# Altium schematic sheet ESC_Header.SchDoc
size A4; SheetNumber: 2; SheetTotal: 2
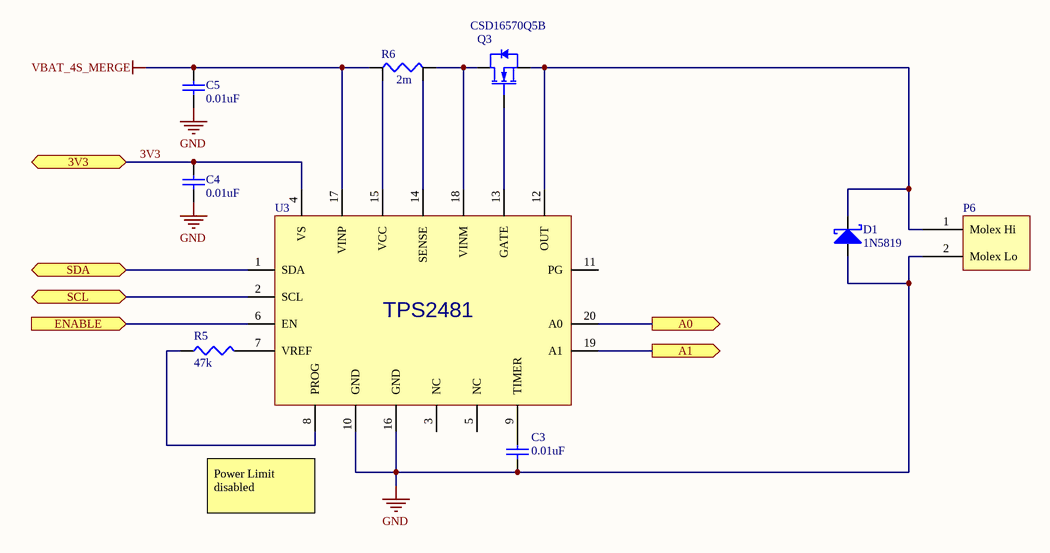
[diagram p0: ESC_Header.SchDoc]

## Parts
C3  value 0.01uF  [C1206]  (hidden comment: Cap Semi)
C4  value 0.01uF  [C1206]  (hidden comment: Cap Semi)
C5  value 0.01uF  [C1206]  (hidden comment: Cap Semi)
D1  1N5819  [1N58xx]
P6  Motor ?  [76829-0102]  (value not drawn)
Q3  CSD16570Q5B  [CSD16570Q5B]
R5  47k  [J1-0603]
R6  2m  [WSL27262L000FEB]
U3  TPS2481  [TPS2481]  (value not drawn)

## Ports
3V3 (bidir), A0 (out), A1 (out), ENABLE (in), SCL (bidir), SDA (bidir)

## Nets
GND: C3.1 C4.1 C5.1 D1.A(Anode) P6.2(Molex_Lo) U3.10(GND) U3.16(GND)
VBAT_4S_MERGE: C5.2 R6.1 U3.17(VINP)
3V3: C4.2 U3.4(VS) ; port 3V3
A0: U3.20(A0) ; port A0
A1: U3.19(A1) ; port A1
ENABLE: U3.6(EN) ; port ENABLE
SCL: U3.2(SCL) ; port SCL
SDA: U3.1(SDA) ; port SDA
NetC3_2: C3.2 U3.9(TIMER)
NetD1_K: D1.K(Cathode) P6.1(Molex_Hi) Q3.S(Source) U3.12(OUT)
NetQ3_D: Q3.D(Drain) R6.2 U3.18(VINM)
NetQ3_G: Q3.G(Gate) U3.13(GATE)
NetR5_1: R5.1 U3.8(PROG)
NetR5_2: R5.2 U3.7(VREF)
NetR6_3: R6.3 U3.15(VCC)
NetR6_4: R6.4 U3.14(SENSE)

Not connected (* = marked no-connect by the designer): U3 3(NC) 5(NC) 11(PG)

## Notes on the sheet
- Power Limit disabled

## Library data of the parts
C3-C5 = Cap Semi: Capacitor (Semiconductor SIM Model); Published: 8-Jun-2000; LatestRevisionDate: 29-May-2009; LatestRevisionNote: IPC-7351 Footprint Added.; PackageReference: C1206; Publisher: Altium Limited; PackageDescription: Chip Capacitor
D1 = 1N58xx: 1A Schottky Barrier Rectifier Diode; Datasheet: http://www.kesenes.com/pdf/1n5817-1n5819.pdf
P6 = Megafit Slim Vert 2 Peg: mfgr_part_num: 76829-0102
Q3 = CSD16570Q5B: MOSFET N-CH 25V 100A 8VSON; Manufacturer: Texas Instruments; Packing: Reel; QG: 250 nC; RDS (on) (max): 0.59 mOhm; VGS(th) (max): 1.9 V; VGS (max): 20 V; Supplier 1: Digikey; Supplier Part Number 1: 296-47753-1-ND; ID (max): 100 A; VDS (max): 25 V; Mounting Technology: Surface Mount; PartNumber: CSD16570Q5B; ComponentLink1Description: Manufacturer URL; ComponentLink1URL: http://www.ti.com/; ComponentLink2Description: Datasheet; ComponentLink2URL: http://www.ti.com/lit/ds/symlink/csd16570q5b.pdf; Digikey Link: https://www.digikey.com/product-detail/en/texas-instruments/CSD16570Q5B/296-47753-1-ND/8133102
R5 = Res3: Resistor; Published: 8-Jun-2000; LatestRevisionDate: 29-May-2009; LatestRevisionNote: IPC-7351 Footprint Added.; PackageReference: J1-0603; Publisher: Altium Limited; PackageDescription: Chip Resistor
R6 = WSL27262L000FEB: 2 mOhms ±1% 3W Chip Resistor Nonstandard Anti-Sulfur, Automotive AEC-Q200, Current Sense, Moisture Resistant, Pulse Withstanding Metal Element; Digikey Link: https://www.digikey.com/product-detail/en/vishay-dale/WSL27262L000FEB/WSLQ-.002CT-ND/2695218; Datasheet Link: http://www.vishay.com/docs/30131/wsl2726.pdf
U3 = TPS2481: Positive voltage, intelligent protection device/hotswap controller and I2C current monitor; Digikey_Link: https://www.digikey.com/product-detail/en/texas-instruments/TPS2481PWR/296-27643-1-ND/2345432; Datasheet_Link: http://www.ti.com/lit/ds/symlink/tps2481.pdf